# EAGLE design triple filter (EAGLE 7.1.0)
BN-0001 Triple Filter
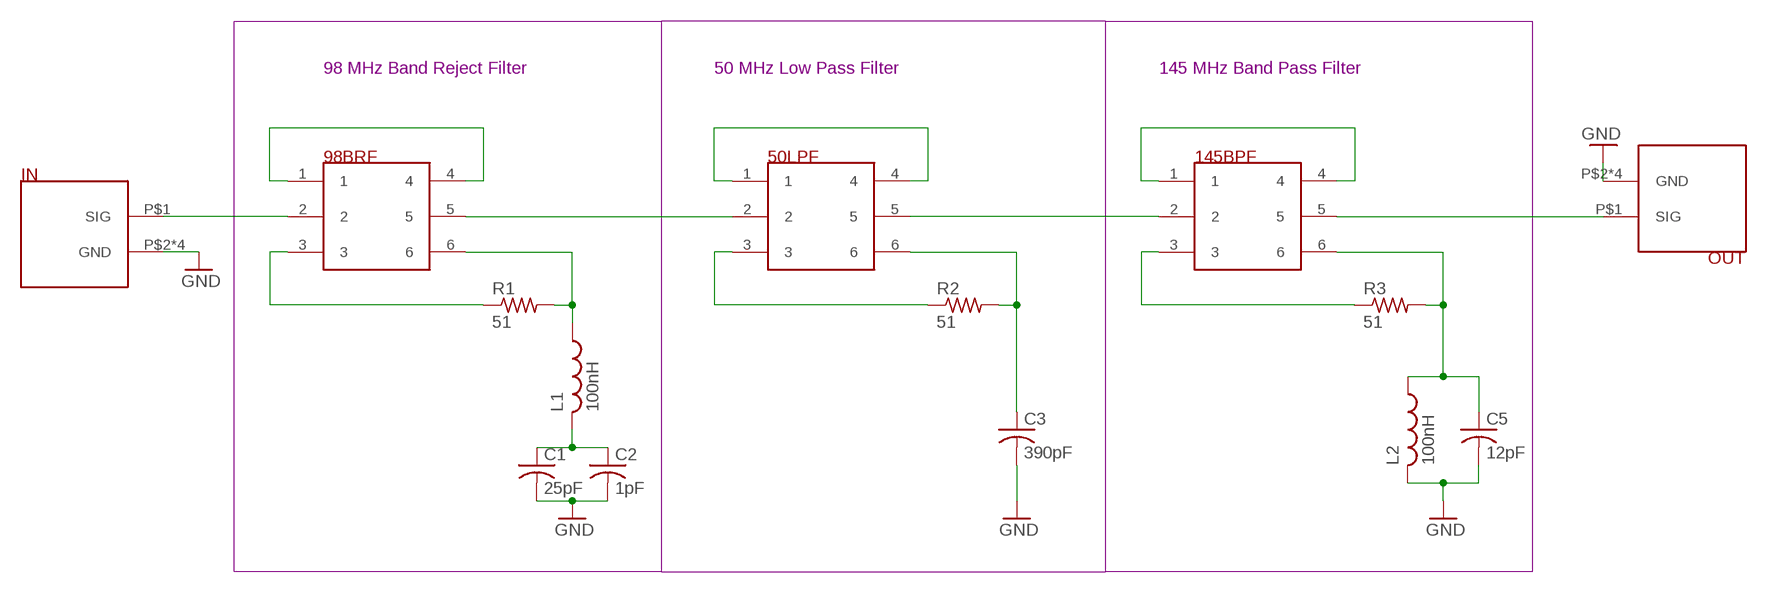
[diagram p0: schematic, sheet 1]

## Parts
50LPF  JS202011SCQN  [JS202011SCQN]
98BRF  JS202011SCQN  [JS202011SCQN]
145BPF  JS202011SCQN  [JS202011SCQN]
C1  25pF  C-USC0805  [C0805]
C2  1pF  C-USC0805  [C0805]
C3  390pF  C-USC0805  [C0805]
C5  12pF  C-USC0805  [C0805]
IN  SMA-CONN  [SMA-CONN]
L1  100nH  L-USL2012C  [L2012C]
L2  100nH  L-USL2012C  [L2012C]
OUT  SMA-CONN  [SMA-CONN]
R1  51  R-US_R0805  [R0805]
R2  51  R-US_R0805  [R0805]
R3  51  R-US_R0805  [R0805]

## Nets
GND: C1.2 C2.2 C3.2 C5.2 IN.P$2(GND) IN.P$3(GND) IN.P$4(GND) IN.P$5(GND) L2.2 OUT.P$2(GND) OUT.P$3(GND) OUT.P$4(GND) OUT.P$5(GND)
N$1: 98BRF.1 98BRF.4
N$2: C1.1 C2.1 L1.2
N$3: 98BRF.2 IN.P$1(SIG)
N$4: 145BPF.5 OUT.P$1(SIG)
N$5: 98BRF.3 R1.1
N$6: 50LPF.1 50LPF.4
N$7: 50LPF.2 98BRF.5
N$8: 50LPF.3 R2.1
N$9: 50LPF.5 145BPF.2
N$10: 145BPF.1 145BPF.4
N$12: 145BPF.3 R3.1
OUT1: 98BRF.6 L1.1 R1.2
OUT2: 50LPF.6 C3.1 R2.2
OUT3: 145BPF.6 C5.1 L2.1 R3.2

## Notes on the sheet
- 98 MHz Band Reject Filter | 50 MHz Low Pass Filter | 145 MHz Band Pass Filter

## Library data of the parts
50LPF 98BRF 145BPF = switch:JS202011SCQN: DPDT Switch JS202011SCQN
C1-C3 C5 = resistor:C-US: CAPACITOR, American symbol
IN OUT = sma:SMA-CONN
L1 L2 = resistor:L-US: INDUCTOR, American symbol
R1-R3 = resistor:R-US_: RESISTOR, American symbol

## Board
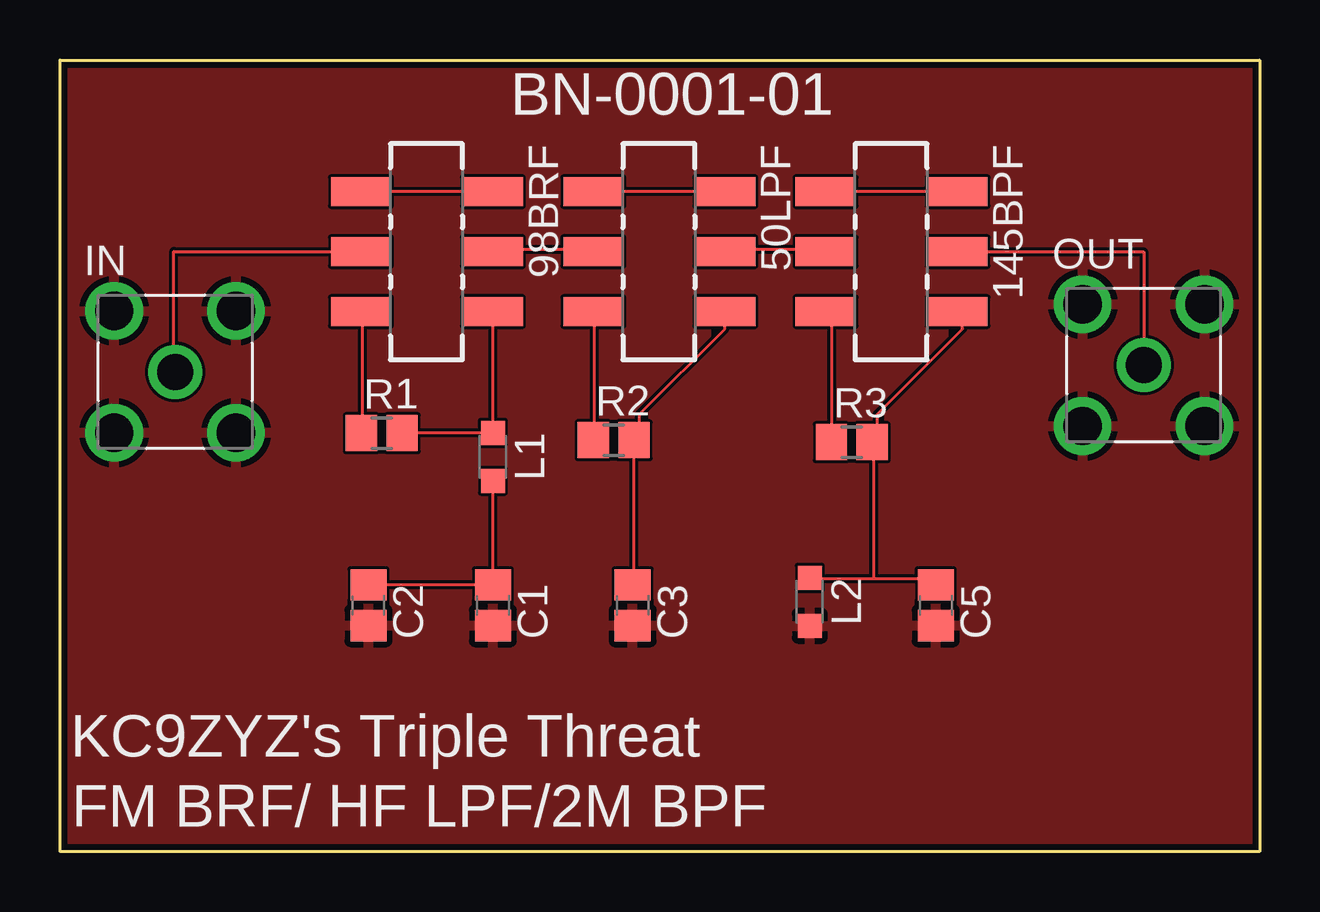
[diagram p1: board, top side]
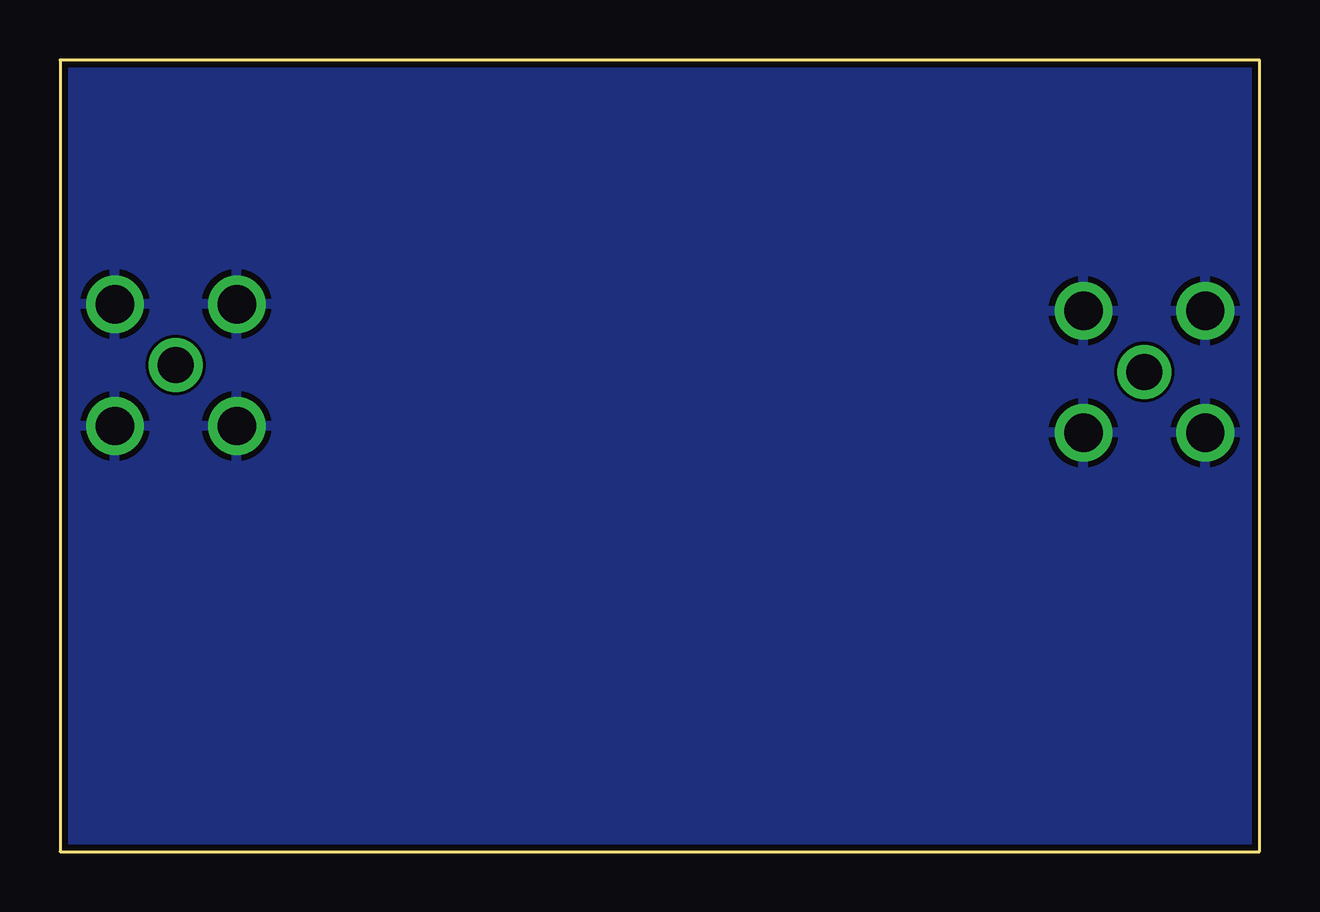
[diagram p2: board, bottom side, seen from below]

Size 50 x 33 mm. Coordinates in mm from the lower left corner, seen from the top.
Outline: 0,0 0,33 50,33 50,0 0,0
Copper layers (1*16): Top 0.035mm / dielectric 1.5mm / Bottom 0.035mm
Design rules "dirt_cheap_dirty_boards.v1": minimum track width 5mil, minimum drill 12mil, track to track 5mil, track to pad 5mil, pad to pad 5mil, via to via 5mil, smd to smd 0mil, copper to edge 10mil, drill to drill 10mil, minimum pad ring 10mil, minimum via ring 6mil, stop-mask expansion 2mil, vias tented up to drill 25mil, thermal gap 10mil

### Footprints (pad centres in the part's own frame; a part is rotated, then mirrored left to right if it is on the bottom)
JS202011SCQN = smd 1.2 x 2.5: 1 -2.5,-2.73; 2 0,-2.73; 3 2.5,-2.73; 4 -2.5,2.77; 5 0,2.77; 6 2.5,2.77
C0805 = smd 1.3 x 1.5: 1 -0.85,0; 2 0.85,0
SMA-CONN = drill 1.5: P$1 0,0 | drill 1.6: P$2 2.54,2.54; P$3 2.54,-2.54; P$4 -2.54,2.54; P$5 -2.54,-2.54
L2012C = smd 1 x 1: 1 -1,0; 2 1,0
R0805 = smd 1.3 x 1.5: 1 -0.85,0; 2 0.85,0

### Placement (x,y rotation side)
50LPF  24.96,25.01 270 top
98BRF  15.28,25.01 270 top
145BPF  34.64,25.01 270 top
C1  18.05,10.27 270 top
C2  12.86,10.27 270 top
C3  23.87,10.27 270 top
C5  36.51,10.27 270 top
IN  4.8,20 0 top
L1  18.05,16.45 270 top
L2  31.25,10.41 270 top
OUT  45.17,20.28 0 top
R1  13.41,17.44 0 top
R2  23.08,17.15 0 top
R3  33,17.07 0 top

### Tracks (layer width: path | path; a pad name or v marks a point on that pad's centre or on a via)
GND
  pour Bottom: -1.41,34.42 51.96,34.61 51.96,-1.17 -1.48,-1.17 -1.61,34.37
  pour Top: -1.79,35.47 53.68,35.47 53.68,-2.46 -2.09,-2.46 -2.09,35.47
N$1
  Top 0.127: 98BRF.1 12.6,27.5 17.93,27.5 98BRF.4
N$2
  Top 0.127: L1.2 18.06,15.44 18.06,11.25 C1.1 17.93,11.12 12.98,11.12 C2.1
N$3
  Top 0.127: IN.P$1 4.74,20 4.74,25.02 98BRF.2
  Top 0.406: 98BRF.2
N$4
  Top 0.127: 145BPF.5 45.17,25.01 OUT.P$1
N$5
  Top 0.127: R1.1 12.6,17.47 12.6,22.42 98BRF.3
N$6
  Top 0.127: 50LPF.1 22.25,27.5 27.71,27.5 50LPF.4
N$7
  Top 0.127: 98BRF.5 18.06,25.09 22.12,25.09 50LPF.2
N$8
  Top 0.127: R2.1 22.25,17.21 22.25,22.42 50LPF.3
N$9
  Top 0.127: 50LPF.5 27.84,25.09 32.16,25.09 145BPF.2
N$10
  Top 0.127: 145BPF.1 32.28,27.5 37.62,27.5 145BPF.4
N$12
  Top 0.127: R3.1 32.16,17.09 32.16,22.42 145BPF.3
OUT1
  Top 0.127: R1.2 14.38,17.47 17.93,17.47 L1.1 18.06,17.47 18.06,22.42 98BRF.6
OUT2
  Top 0.127: C3.1 23.9,11.25 23.9,17.09 R2.2 24.03,17.21 24.16,17.34 24.16,18.23 27.71,21.79 27.71,22.42 50LPF.6
OUT3
  Top 0.127: 33.94,11.37 36.35,11.37 36.48,11.25 C5.1 | 33.94,11.37 31.27,11.37 L2.1 | 33.94,11.37 33.94,16.96 R3.2 33.94,17.09 34.06,17.21 34.06,18.23 37.62,21.79 37.62,22.42 145BPF.6

### Text on the board
tPlace: BN-0001-01 | KC9ZYZ's Triple Threat | FM BRF/ HF LPF/2M BPF